# Altium schematic sheet MOSFET and current Sense.SchDoc
size 431 x 279 mm; SheetNumber: 5; SheetTotal: 6
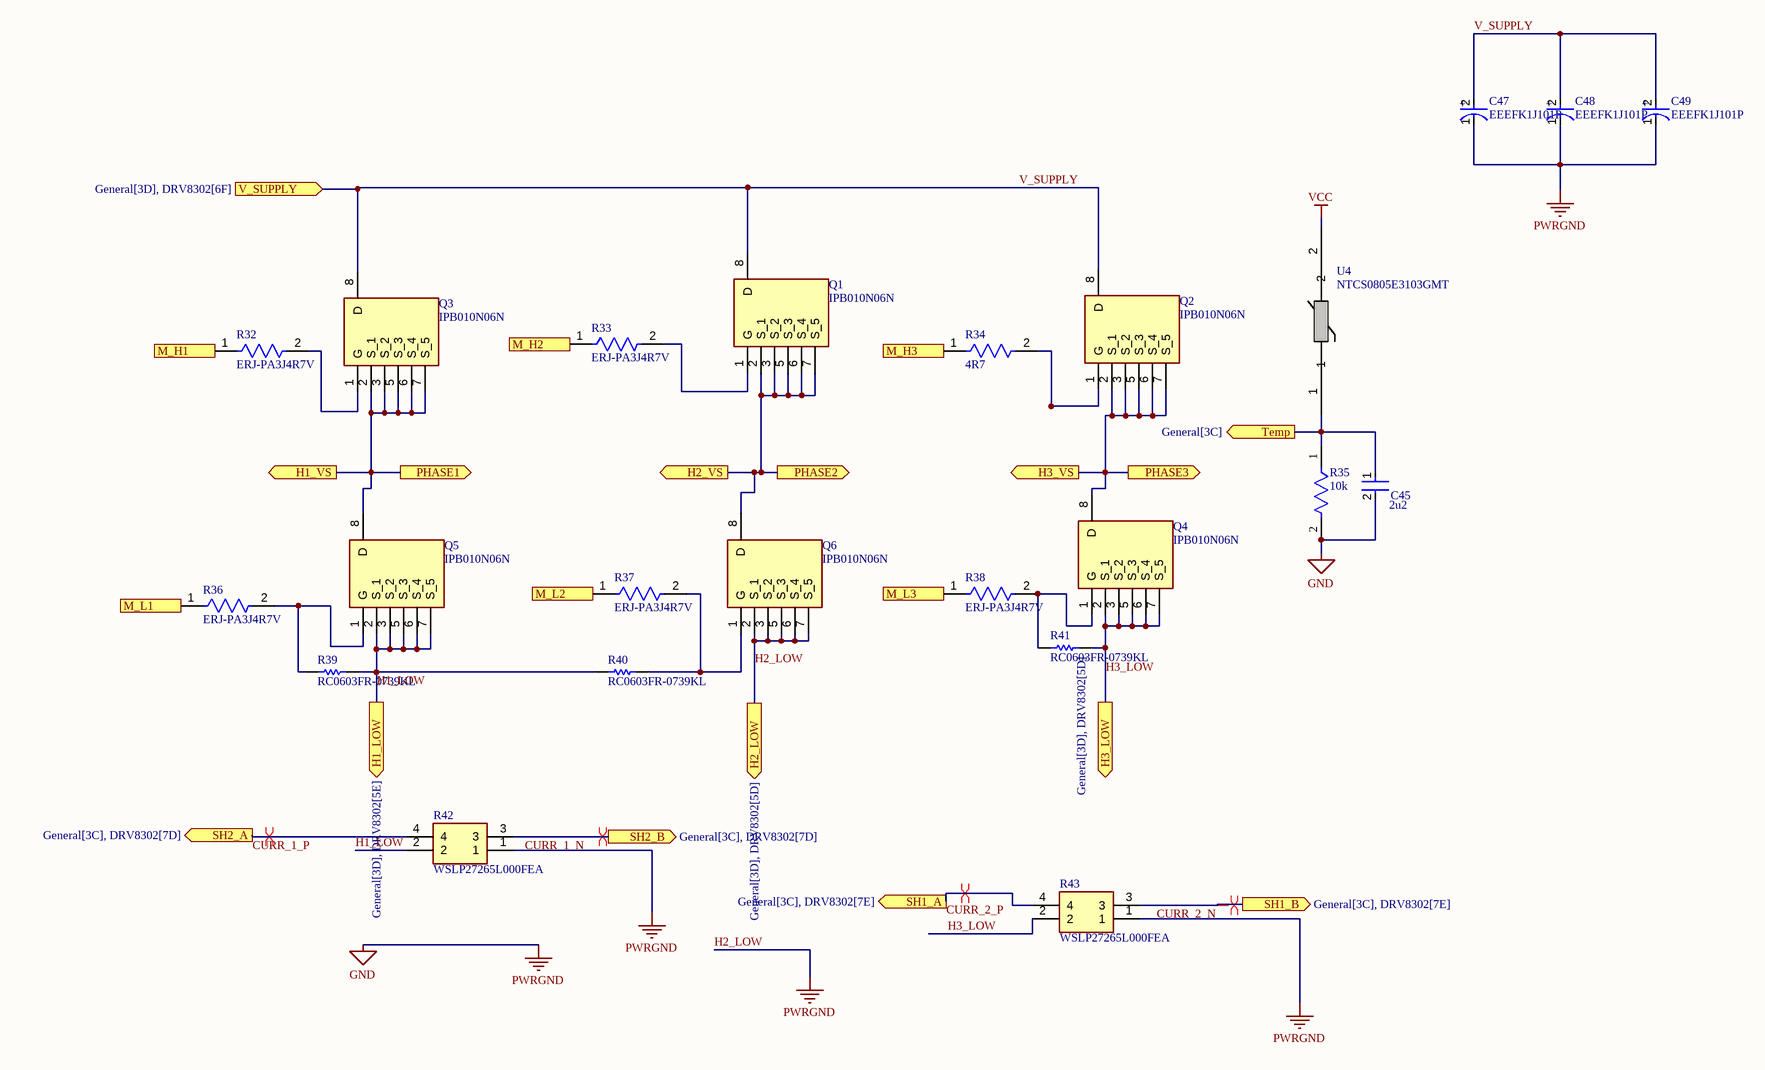
[diagram p0: MOSFET and current Sense.SchDoc]

## Parts
C45  2u2  [FP-GRM188-0_1-e0_2_0_5-MFG]
C47  EEEFK1J101P  [FP-FKG-MFG]
C48  EEEFK1J101P  [FP-FKG-MFG]
C49  EEEFK1J101P  [FP-FKG-MFG]
Q1  IPB010N06N  [PG-TO263-7-3_3]
Q2  IPB010N06N  [PG-TO263-7-3_3]
Q3  IPB010N06N  [PG-TO263-7-3_3]
Q4  IPB010N06N  [PG-TO263-7-3_3]
Q5  IPB010N06N  [PG-TO263-7-3_3]
Q6  IPB010N06N  [PG-TO263-7-3_3]
R32  ERJ-PA3J4R7V  [FP-ERJPA3-IPC_C]
R33  ERJ-PA3J4R7V  [FP-ERJPA3-IPC_C]
R34  4R7  [FP-ERJPA3-IPC_C]
R35  10k  [FP-ERA3A-IPC_C]
R36  ERJ-PA3J4R7V  [FP-ERJPA3-IPC_C]
R37  ERJ-PA3J4R7V  [FP-ERJPA3-IPC_C]
R38  ERJ-PA3J4R7V  [FP-ERJPA3-IPC_C]
R39  RC0603FR-0739KL  [RESC1608X55X25LL10T15]
R40  RC0603FR-0739KL  [RESC1608X55X25LL10T15]
R41  RC0603FR-0739KL  [RESC1608X55X25LL10T15]
R42  WSLP27265L000FEA  [WSLP27265L000FEA]
R43  WSLP27265L000FEA  [WSLP27265L000FEA]
U4  NTCS0805E3103GMT  [NTCS0805_VIS]

## Ports
H1_LOW (out, see General[3D], DRV8302[5E]), H1_VS (out, see General[3D], DRV8302[4C]), H2_LOW (out, see General[3D], DRV8302[5D]), H2_VS (out, see General[3D], DRV8302[4C]), H3_LOW (out, see General[3D], DRV8302[5D]), H3_VS (out, see General[3D], DRV8302[4C]), M_H1 (in, see General[3D], DRV8302[5E]), M_H2 (in, see General[3D], DRV8302[5E]), M_H3 (in, see General[3D], DRV8302[5D]), M_L1 (in, see General[3D], DRV8302[5E]), M_L2 (in, see General[3D], DRV8302[5D]), M_L3 (in, see General[3D], DRV8302[5D]), PHASE1 (out, see General[2D]), PHASE2 (out, see General[2D]), PHASE3 (out, see General[2D]), SH1_A (out, see General[3C], DRV8302[7E]), SH1_B (out, see General[3C], DRV8302[7E]), SH2_A (out, see General[3C], DRV8302[7D]), SH2_B (out, see General[3C], DRV8302[7D]), Temp (out, see General[3C]), V_SUPPLY (in, see General[3D], DRV8302[6F])

## Nets
H2_LOW: C45.2 C47.1(C) C48.1(C) C49.1(C) Q6.2(S_1) Q6.3(S_2) Q6.5(S_3) Q6.6(S_4) Q6.7(S_5) R35.2 R42.1 R43.1 ; port H2_LOW  [also labelled GND, PWRGND]
VCC: U4.2
CURR_1_N: R42.3 ; port SH2_B
CURR_1_P: R42.4 ; port SH2_A
CURR_2_N: R43.3 ; port SH1_B
CURR_2_P: R43.4 ; port SH1_A
H1_LOW: Q5.2(S_1) Q5.3(S_2) Q5.5(S_3) Q5.6(S_4) Q5.7(S_5) R39.2 R40.1 R42.2 ; port H1_LOW
H1_VS: Q3.2(S_1) Q3.3(S_2) Q3.5(S_3) Q3.6(S_4) Q3.7(S_5) Q5.8(D) ; port H1_VS, port PHASE1
H2_VS: Q1.2(S_1) Q1.3(S_2) Q1.5(S_3) Q1.6(S_4) Q1.7(S_5) Q6.8(D) ; port H2_VS, port PHASE2
H3_LOW: Q4.2(S_1) Q4.3(S_2) Q4.5(S_3) Q4.6(S_4) Q4.7(S_5) R41.2 R43.2 ; port H3_LOW
H3_VS: Q2.2(S_1) Q2.3(S_2) Q2.5(S_3) Q2.6(S_4) Q2.7(S_5) Q4.8(D) ; port H3_VS, port PHASE3
M_H1: R32.1 ; port M_H1
M_H2: R33.1 ; port M_H2
M_H3: R34.1 ; port M_H3
M_L1: R36.1 ; port M_L1
M_L2: R37.1 ; port M_L2
M_L3: R38.1 ; port M_L3
Temp: C45.1 R35.1 U4.1 ; port Temp
V_SUPPLY: C47.2(A) C48.2(A) C49.2(A) Q1.8(D) Q2.8(D) Q3.8(D) ; port V_SUPPLY
NetQ1_1: Q1.1(G) R33.2
NetQ2_1: Q2.1(G) R34.2
NetQ3_1: Q3.1(G) R32.2
NetQ4_1: Q4.1(G) R38.2 R41.1
NetQ5_1: Q5.1(G) R36.2 R39.1
NetQ6_1: Q6.1(G) R37.2 R40.2

## Layout directives
differential pair: CURR_1_N, CURR_1_P, CURR_2_N, CURR_2_P

## Notes on the sheet
- DWG. NO.
- REV.
- SHT.
- THIS DOCUMENT AND THE DATA DISCLOSED HEREIN OR HEREWITH IS THE PROPERTY OF ALTIUM LIMITED AND MAY BE FREELY DISTRIBUTED IN WHOLE. NO RIGHTS ARE RESERVED OR EXPRESS OR IMPLIED WARANTEE GIVEN.
- REVISION
- DESCRIPTION
- DATE
- APPROVED
- ENG:
- APPROVALS
- PROJECT
- DSN:
- CHK:
- REFERENCE DOCUMENTS
- PROJECT REVISION:
- TITLE
- DOCUMENT REVISION:
- DESIGN ITEM:
- BOM:
- FAB DWG:
- PCB DWG:
- ASSY DWG:
- SCALE:
- SIZE
- B
- CAGE CODE
- FILE NAME
- DWG NO.
- SHEET
- OF
- REV
- (in symbol CMP-05427-000067-1) +

## Library data of the parts
C45 = CMP-2006-02836-2: Chip Multilayer Ceramic Capacitors for General Purpose, 0603, 2.2uF, X7R, 15%, 10%, 10V; Case Code (Metric): 1608; Height: 0.8mm; Packaging: Cut Tape; Voltage: 10V; Lead Free: Lead Free; Min Operating Temperature: -55°C; Voltage Rating (DC): 10V; Max Operating Temperature: 125°C; Voltage Rating: 10V; Dielectric: X7R; Depth: 0.8mm; Case Code (Imperial): 0603; Termination: SMD/SMT; Case/Package: 0603; Number of Pins: 2; REACH SVHC: No SVHC; Mount: Surface Mount; Width: 0.031inch; Material: Ceramic; Capacitance: 2.2uF; Package Quantity: 1; Weight: 7.1E-05oz; Length: 1.6mm; Thickness: 0.035inch; Tolerance: 10%
C47-C49 = CMP-05427-000067-1: CAP ALUM 100UF 20% 63V SMD; Material: Aluminium; ESR (Equivalent Series Resistance): 350mR; Life (Hours): 2000Hour; Ripple Current (AC): 400mA; Leakage Current: 3uA; Polarity: Polar; Lead Free: Lead Free; Impedance: 350mR; Packaging: Tape and Reel; Voltage Rating (DC): 63V; Construction: Cylindrical; Ripple Current: 400mA; Min Operating Temperature: -55°C; RoHS Compliant: Yes; Dielectric Material: Aluminium; Termination: SMD/SMT; REACH SVHC: No SVHC; Mount: Surface Mount; Radiation Hardening: No; Width: 12mm; Voltage Rating: 63V; Length: 10.2mm; Voltage: 63V; Tolerance: 20%; Series: FK; Diameter: 10mm; Height: 10.2mm; Max Operating Temperature: 105°C; Capacitance: 100uF; Height - Seated (Max): 0.413inch; Case/Package: Radial; Package Quantity: 1; Contact Plating: Tin
Q1-Q6 = IPB010N06N: MOSFET (N-Channel); Manufacturer_Name: Infineon; Datasheet Link: https://www.infineon.com/dgdl/Infineon-IPB010N06N-DS-v02_04-EN.pdf?fileId=db3a3043353fdc1601355341f17a485f; Manufacturer_Part_Number: IPB010N06N; Mouser Part Number: 726-IPB010N06N; Mouser Price/Stock: https://www.mouser.co.uk/ProductDetail/Infineon-Technologies/IPB010N06N?qs=EUA%2Fg8wssK3txpgcjG7wiw%3D%3D
R32-R34 R36-R38 = CMP-05422-000119-1: RES SMD 4.7 OHM 5% 1/4W 0603; Max Power Dissipation: 250mW; Temperature Coefficient: 200ppm/°C; Resistance: 4.7R; Number of Terminations: 2; Resistor Type: Thick Film; Width: 0.031inch; Features: Automotive AEC-Q200; Case/Package: 0603; Height: 0.018inch; Length: 0.063inch; Max Operating Temperature: 155°C; Min Operating Temperature: -55°C; Case Code (Imperial): 0603; Packaging: Tape and Reel; Case Code (Metric): 1608; Tolerance: 5%
R35 = CMP-2000-00874-2: RES SMD 10K OHM 0.1% 1/10W 0603; Voltage Rating (DC): 75V; Power Rating: 100mW; Resistance: 10kR; Temperature Coefficient: 25ppm/°C; Radiation Hardening: No; Width: 0.8mm; Depth: 0.8mm; Construction: Rectangular; Case Code (Metric): 1608; Package Quantity: 5000; Length: 1.6mm; Size Code: 0603; Case Code (Imperial): 0603; Termination: SMD/SMT; Contact Plating: Tin; Resistance Tolerance: 0.1%; Military Standard: Not; Packaging: Tape and Reel; Max Power Dissipation: 100mW; REACH SVHC: No SVHC; Series: ERA-3A; Voltage Rating: 75V; Lead Free: Lead Free; Technology: METAL FILM; RoHS Compliant: Yes; Max Operating Temperature: 155°C; Resistor Type: Thin Film; Min Operating Temperature: -55°C; Number of Pins: 2; Case/Package: 0603; Tolerance: 0.1%; Height: 0.45mm; Mount: Surface Mount; Number of Terminations: 2
R39-R41 = CMP-2000-06940-1: Chip Resistor, 39 KOhm, +/- 1%, 0.1 W, -55 to 155 degC, 0603 (1608 Metric), RoHS, Tape and Reel; Manufacturer: Yageo; Resistance: 39kOhms; Voltage Rating: 50V; Power Rating: 100mW; Temperature Coefficient: 100PPM/C; Product: ThickFilmResistorsGeneralPurpose; Case Code - in: 0603; Tolerance: 1%; Operating Temperature Range: -55Cto+155C; Series: RC; Package Description: 2-Pin Surface Mount Device, Body 1.6 x 0.8 mm; Datasheet URL: http://www.yageo.com/documents/recent/PYu-RC_Group_51_RoHS_L_7.pdf; Package Reference: 0603; Case Code - mm: 1608; Datasheet Version: Rev. 7, 05/2017; Mounting Technology: SurfaceMount; Packaging: Reel; Manufacturer URL: http://www.yageo.com/; Termination Style: SMD/SMT
R42 R43 = WSLP27265L000FEA: Resistor; Manufacturer_Name: Vishay; Datasheet Link: https://componentsearchengine.com/Datasheets/1/WSLP27265L000FEA.pdf; Height: 2.81mm; Manufacturer_Part_Number: WSLP27265L000FEA; Mouser Part Number: 71-WSLP27265L000FEA; Mouser Price/Stock: https://www.mouser.co.uk/ProductDetail/Vishay-Dale/WSLP27265L000FEA?qs=h6V4JsTaLXeHJBxiH6kbIg%3D%3D
U4 = CMP-00030-42801496-1: NTCS0805E3103GMT Thermistor NTC 10K Ohm 2% 2-Pin 0805 Surface Mount Solder Pad 3570K -4 to -3.5 T/R Automotive; Accuracy: 3%; Power Rating: 210mW; Resistance: 10kΩ; Length: 2mm; Schedule B: 8533400080, 8533400080; Radiation Hardening: No; Case Code (Metric): 2012; Packaging: Digi-Reel®; Mount: Surface Mount; Max Operating Temperature: 150°C; Case Code (Imperial): 0805; Tolerance: 2%; Termination: SMD/SMT; Depth: 1.25mm; Max Power Dissipation: 210mW; Contact Plating: Tin; NexarPartId: 42801496; Min Operating Temperature: -40°C; Number of Pins: 2; RoHS: Compliant; Case/Package: 0805